# Altium schematic sheet DAC.SchDoc: Eval Board -  Analog outputs
size A3; Author: O. Guinnard; Organization: imperix Ltd; Address1: Rue de l'Industrie 10; Address2: 1950 Sion; Address3: Switzerland; Address4: +41 27 552 06 60; DocumentNumber: 2; SheetNumber: 2; SheetTotal: 7
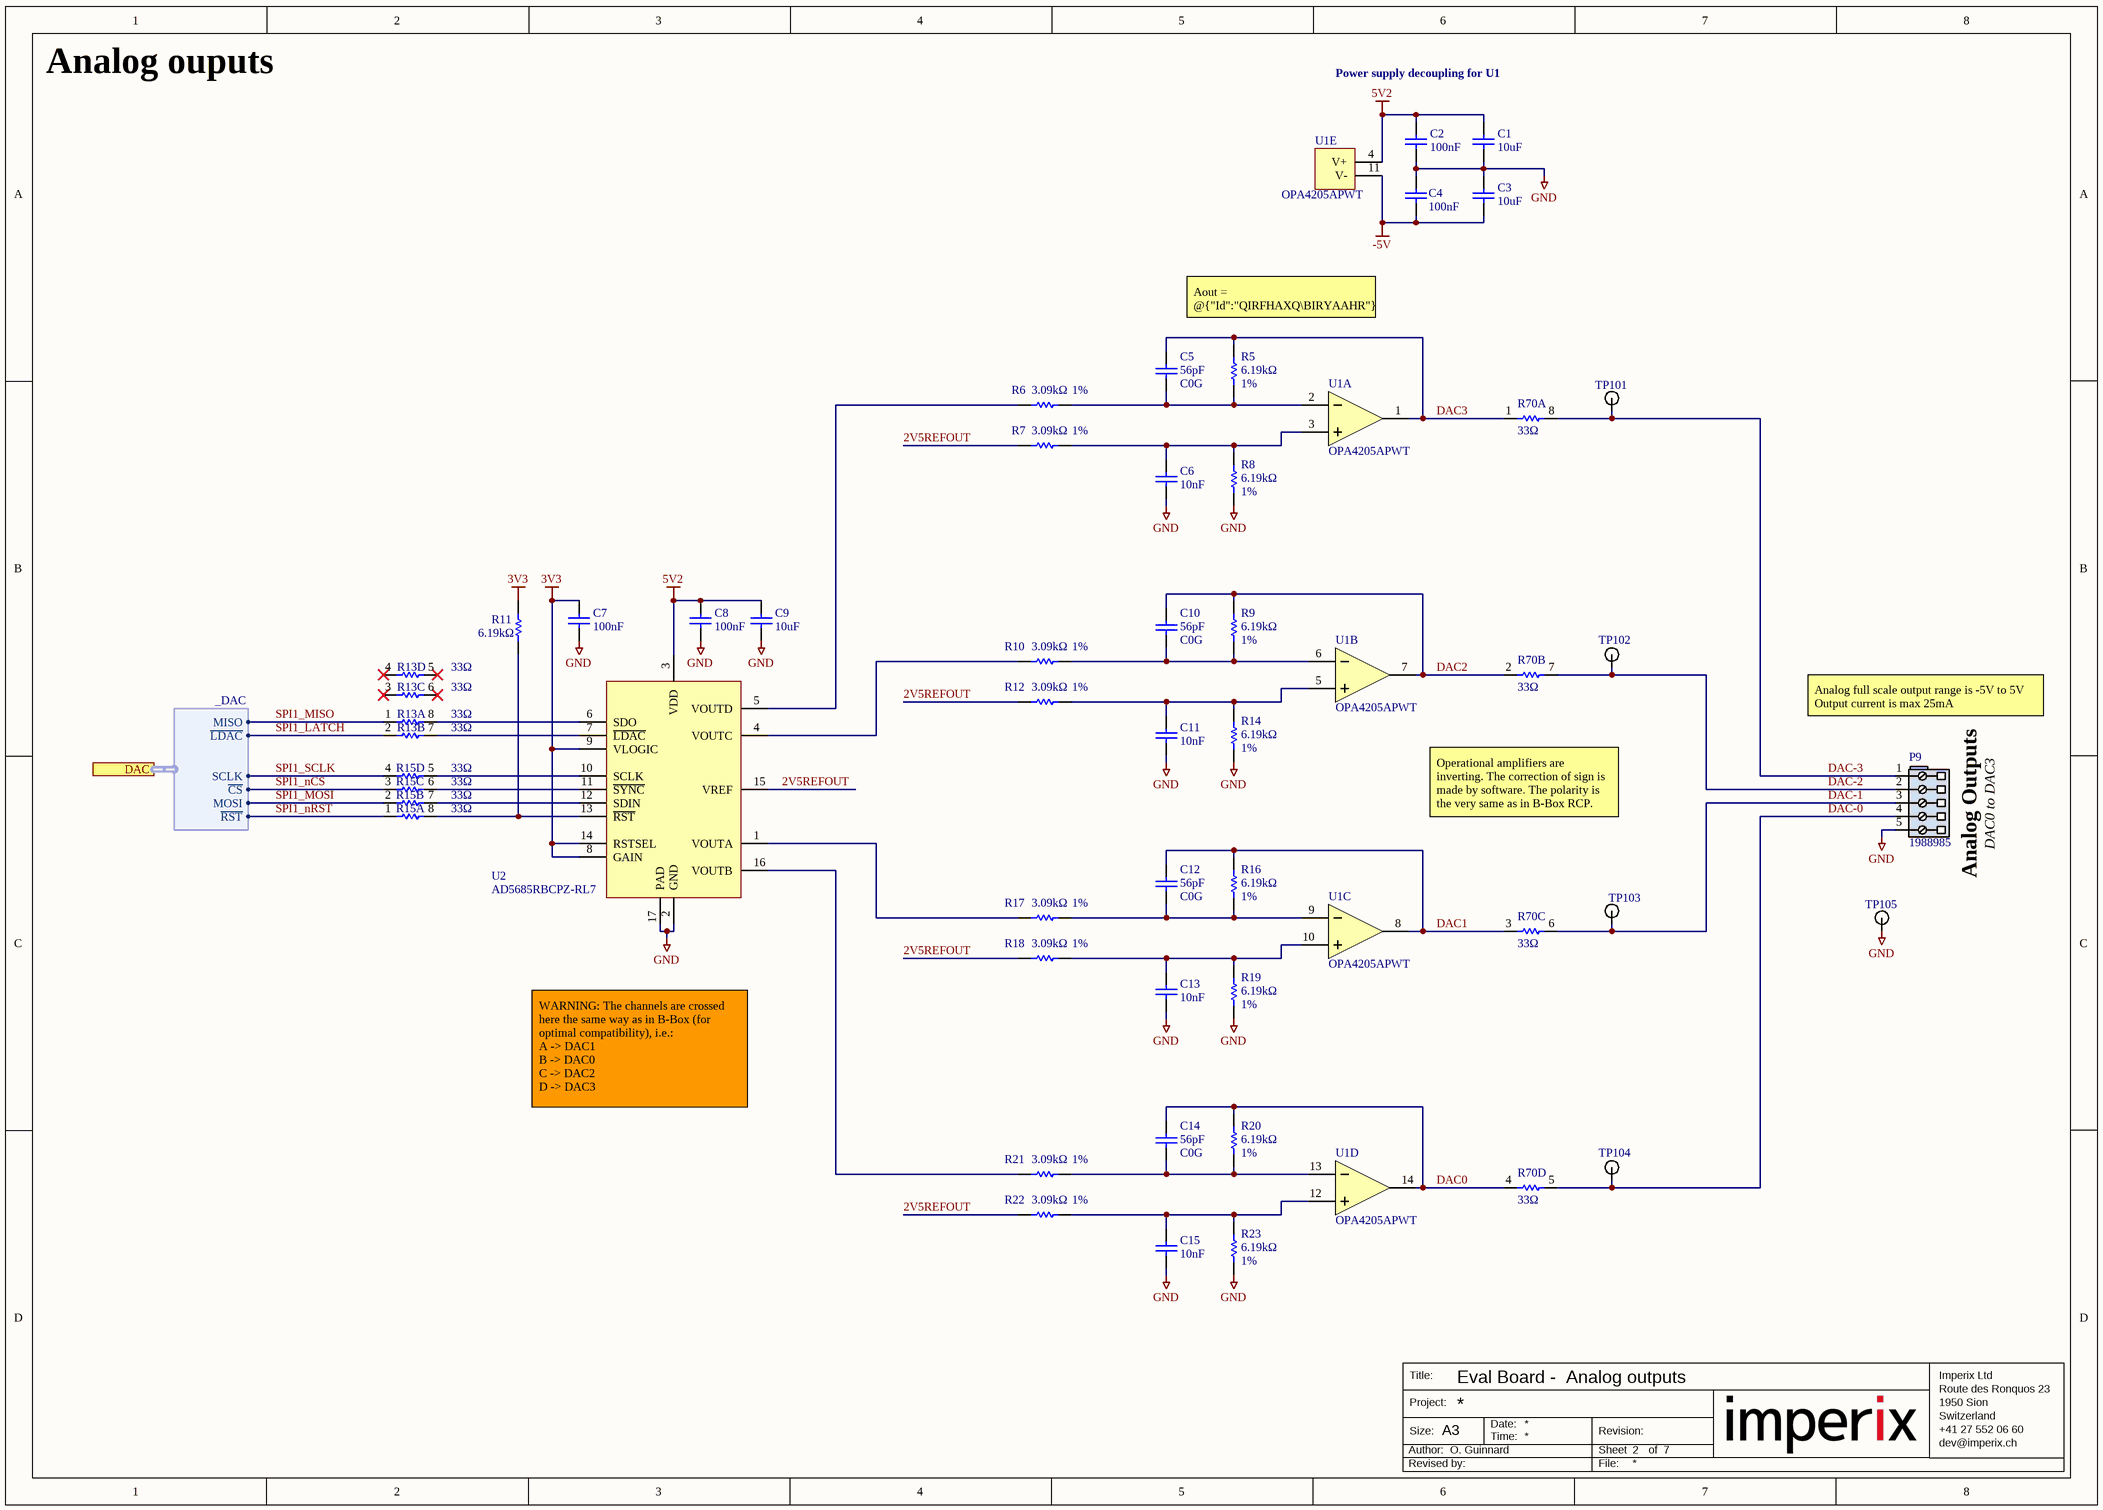
[diagram p0: DAC.SchDoc]

## Parts
C1  value 10uF  [CAPC1608L(0603)]  (hidden comment: CAP-10UF-10V-X5R-0603-10%)
C2  value 100nF  [CAPC1005L(0402)]  (hidden comment: CAP-100NF-25V-X7R-0402-10%)
C3  value 10uF  [CAPC1608L(0603)]  (hidden comment: CAP-10UF-10V-X5R-0603-10%)
C4  value 100nF  [CAPC1005L(0402)]  (hidden comment: CAP-100NF-25V-X7R-0402-10%)
C5  value 56pF  Dielectric: C0G  [CAPC1005L(0402)]  (hidden comment: CAP-56PF-50V-C0G-0402-1%)
C6  value 10nF  [CAPC1005L(0402)]  (hidden comment: CAP-10NF-25V-X7R-0402-10%)
C7  value 100nF  [CAPC1005L(0402)]  (hidden comment: CAP-100NF-25V-X7R-0402-10%)
C8  value 100nF  [CAPC1005L(0402)]  (hidden comment: CAP-100NF-25V-X7R-0402-10%)
C9  value 10uF  [CAPC1608L(0603)]  (hidden comment: CAP-10UF-10V-X5R-0603-10%)
C10  value 56pF  Dielectric: C0G  [CAPC1005L(0402)]  (hidden comment: CAP-56PF-50V-C0G-0402-1%)
C11  value 10nF  [CAPC1005L(0402)]  (hidden comment: CAP-10NF-25V-X7R-0402-10%)
C12  value 56pF  Dielectric: C0G  [CAPC1005L(0402)]  (hidden comment: CAP-56PF-50V-C0G-0402-1%)
C13  value 10nF  [CAPC1005L(0402)]  (hidden comment: CAP-10NF-25V-X7R-0402-10%)
C14  value 56pF  Dielectric: C0G  [CAPC1005L(0402)]  (hidden comment: CAP-56PF-50V-C0G-0402-1%)
C15  value 10nF  [CAPC1005L(0402)]  (hidden comment: CAP-10NF-25V-X7R-0402-10%)
P9  1988985  [1988985]
R5  value 6.19kΩ  Tolerance: 1%  [RESC1005L(0402)]  (hidden comment: RES-6.19KΩ-1/16W-100PPM-0402-1%)
R6  value 3.09kΩ  Tolerance: 1%  [RESC1005L(0402)]  (hidden comment: RES-3.09KΩ-1/16W-100PPM-0402-1%)
R7  value 3.09kΩ  Tolerance: 1%  [RESC1005L(0402)]  (hidden comment: RES-3.09KΩ-1/16W-100PPM-0402-1%)
R8  value 6.19kΩ  Tolerance: 1%  [RESC1005L(0402)]  (hidden comment: RES-6.19KΩ-1/16W-100PPM-0402-1%)
R9  value 6.19kΩ  Tolerance: 1%  [RESC1005L(0402)]  (hidden comment: RES-6.19KΩ-1/16W-100PPM-0402-1%)
R10  value 3.09kΩ  Tolerance: 1%  [RESC1005L(0402)]  (hidden comment: RES-3.09KΩ-1/16W-100PPM-0402-1%)
R11  value 6.19kΩ  [RESC1005L(0402)]  (hidden comment: RES-6.19KΩ-1/16W-100PPM-0402-1%)
R12  value 3.09kΩ  Tolerance: 1%  [RESC1005L(0402)]  (hidden comment: RES-3.09KΩ-1/16W-100PPM-0402-1%)
R13  value 33Ω  [RESQUAD0804]  (hidden comment: EXB-28V330JX)  (parts A,B,C,D of 4)
R14  value 6.19kΩ  Tolerance: 1%  [RESC1005L(0402)]  (hidden comment: RES-6.19KΩ-1/16W-100PPM-0402-1%)
R15  value 33Ω  [RESQUAD0804]  (hidden comment: EXB-28V330JX)  (parts A,B,C,D of 4)
R16  value 6.19kΩ  Tolerance: 1%  [RESC1005L(0402)]  (hidden comment: RES-6.19KΩ-1/16W-100PPM-0402-1%)
R17  value 3.09kΩ  Tolerance: 1%  [RESC1005L(0402)]  (hidden comment: RES-3.09KΩ-1/16W-100PPM-0402-1%)
R18  value 3.09kΩ  Tolerance: 1%  [RESC1005L(0402)]  (hidden comment: RES-3.09KΩ-1/16W-100PPM-0402-1%)
R19  value 6.19kΩ  Tolerance: 1%  [RESC1005L(0402)]  (hidden comment: RES-6.19KΩ-1/16W-100PPM-0402-1%)
R20  value 6.19kΩ  Tolerance: 1%  [RESC1005L(0402)]  (hidden comment: RES-6.19KΩ-1/16W-100PPM-0402-1%)
R21  value 3.09kΩ  Tolerance: 1%  [RESC1005L(0402)]  (hidden comment: RES-3.09KΩ-1/16W-100PPM-0402-1%)
R22  value 3.09kΩ  Tolerance: 1%  [RESC1005L(0402)]  (hidden comment: RES-3.09KΩ-1/16W-100PPM-0402-1%)
R23  value 6.19kΩ  Tolerance: 1%  [RESC1005L(0402)]  (hidden comment: RES-6.19KΩ-1/16W-100PPM-0402-1%)
R70  value 33Ω  [RESQUAD0804]  (hidden comment: EXB-28V330JX)  (parts A,B,C,D of 4)
TP101  5001  [5001]  (value not drawn)
TP102  5001  [5001]  (value not drawn)
TP103  5001  [5001]  (value not drawn)
TP104  5001  [5001]  (value not drawn)
TP105  5001  [5001]  (value not drawn)
U1  OPA4205APWT  [TSSOP65P640-14N]  (parts A,B,C,D,E of 5)
U2  AD5685RBCPZ-RL7  [QFN50P300X300-16WAL]

## Ports
DAC (harness _DAC)

## Harnesses
_DAC: MOSI, MISO, SCLK, ~{CS}, ~{LDAC}, ~{RST}

## Nets
3V3: C7.2 R11.2 U2.8(GAIN) U2.9(VLOGIC) U2.14(RSTSEL)
5V2: C1.2 C2.2 C8.2 C9.2 U1.4(V+) U2.3(VDD)
-5V: C3.1 C4.1 U1.11(V-)
GND: C1.1 C2.1 C3.2 C4.2 C6.1 C7.1 C8.1 C9.1 C11.1 C13.1 C15.1 P9.5 R8.1 R14.1 R19.1 R23.1 TP105.1(TP) U2.2(GND) U2.17(PAD)
2V5REFOUT: R7.2 R12.2 R18.2 R22.2 U2.15(VREF)
DAC0: C14.2 R20.2 R70.4 U1.14(OUT)
DAC1: C12.2 R16.2 R70.3 U1.8(OUT)
DAC2: C10.2 R9.2 R70.2 U1.7(OUT)
DAC3: C5.2 R5.2 R70.1 U1.1(OUT)
DAC-0: P9.4 R70.5 TP104.1(TP)
DAC-1: P9.3 R70.6 TP103.1(TP)
DAC-2: P9.2 R70.7 TP102.1(TP)
DAC-3: P9.1 R70.8 TP101.1(TP)
SPI1_LATCH: R13.2 ; port DAC.~{LDAC}
SPI1_MISO: R13.1 ; port DAC.MISO
SPI1_MOSI: R15.2 ; port DAC.MOSI
SPI1_nCS: R15.3 ; port DAC.~{CS}
SPI1_nRST: R15.1 ; port DAC.~{RST}
SPI1_SCLK: R15.4 ; port DAC.SCLK
NetC5_1: C5.1 R5.1 R6.1 U1.2(IN-)
NetC6_2: C6.2 R7.1 R8.2 U1.3(IN+)
NetC10_1: C10.1 R9.1 R10.1 U1.6(IN-)
NetC11_2: C11.2 R12.1 R14.2 U1.5(IN+)
NetC12_1: C12.1 R16.1 R17.1 U1.9(IN-)
NetC13_2: C13.2 R18.1 R19.2 U1.10(IN+)
NetC14_1: C14.1 R20.1 R21.1 U1.13(IN-)
NetC15_2: C15.2 R22.1 R23.2 U1.12(IN+)
NetR6_2: R6.2 U2.5(VOUTD)
NetR10_2: R10.2 U2.4(VOUTC)
NetR11_1: R11.1 R15.8 U2.13(~{RST})
NetR13_7: R13.7 U2.7(~{LDAC})
NetR13_8: R13.8 U2.6(SDO)
NetR15_5: R15.5 U2.10(SCLK)
NetR15_6: R15.6 U2.11(~{SYNC})
NetR15_7: R15.7 U2.12(SDIN)
NetR17_2: R17.2 U2.1(VOUTA)
NetR21_2: R21.2 U2.16(VOUTB)

Not connected (* = marked no-connect by the designer): R13 3* 4* 5* 6*

## Notes on the sheet
- Analog ouputs
- Power supply decoupling for U1
- Aout = @{"Id":"QIRFHAXQ\BIRYAAHR"} / @{"Id":"QIRFHAXQ\GPNTABEF"} *(Vref-Vin)
  = 2*(Vref-Vin)
- Analog full scale output range is -5V to 5V
  Output current is max 25mA
- Operational amplifiers are inverting. The correction of sign is made by software. The polarity is the very same as in B-Box RCP.
- (near P9) Analog Outputs
- DAC0 to DAC3
- WARNING: The channels are crossed here the same way as in B-Box (for optimal compatibility), i.e.:
  A -> DAC1
  B -> DAC0
  C -> DAC2
  D -> DAC3
- Title:
- Imperix Ltd
- Route des Ronquos 23
- Author:
- Project:
- Size:
- A3
- Date:
- Time:
- Revision:
- Sheet
- of
- 1950 Sion
- Switzerland
- +41 27 552 06 60
- dev@imperix.ch
- Revised by:
- File:

## Library data of the parts
C1 C3 C9 = CMP-055-000003-7: CAP CER 10UF 10V X5R 0603 10% (Generic Imperix Component); Tolerance: 10%; Dielectric: X5R; Voltage Rating (DC): 10V; Case/Package: 0603
C2 C4 C7 C8 = CMP-004-000006-18: CAP CER 100NF 25V X7R 0402 10% (Generic Imperix Component); Tolerance: 10%; Case/Package: 0402; Dielectric: X7R; Voltage Rating (DC): 25V
C5 C10 C12 C14 = CMP-027-000004-13: CAP CER 56PF 50V C0G 0402 1% (Generic Imperix Component); Tolerance: 1%; Case/Package: 0402; Voltage Rating (DC): 50V
C6 C11 C13 C15 = CMP-012-000001-12: CAP CER 10NF 25V X7R 0402 10% (Generic Imperix Component); Tolerance: 10%; Case/Package: 0402; Voltage Rating (DC): 25V; Dielectric: X7R
P9 = CMP-003-000046-13: Conn PC Terminal Block 5 POS 3.5mm Solder Thru-Hole 17.5A; Number of Poles: 5; Voltage: 300V; Current: 10A; Approvals: UL,EAC; Number of Levels: 1; Wire Gauge (Max): 26AWG; Gender: Male; Wire Gauge (Min): 16AWG; Voltage Rating: 160V; Number of Rows: 1; Mounting Technology: Through Hole; Lead Free: Lead Free; Color: Green; Number of Positions: 5; Orientation: Straight; Weight: 0.086068oz; Max Current Rating: 17.5A; Number of Circuits: 5; Number of Positions Per Level: 5; Packaging: Bulk; Pitch: 3.5mm; Current Rating: 17.5A; Material: Polyamide; Series: COMBICON PTA; Length: 11.2mm; Pins: 5; Height: 13.7mm; Housing Material: Nylon; Number of Contacts: 5; Contact Material: Tin; RoHS Compliant: Yes; Width: 17.5mm; Depth: 9.9mm; Housing Color: Green; Package Quantity: 100; Termination: Screw; Flammability Rating: UL94 V-0
R5 R8 R9 R11 R14 R16 R19 R20 R23 = CMP-009-000034-6: RES SMD 6.19KΩ 1/16W 100PPM 0402 1% (Generic Imperix Component); Temperature Coefficient: 100ppm/°C; Power Rating: 1/16W; Case/Package: 0402
  R11: Tolerance: 1%
R6 R7 R10 R12 R17 R18 R21 R22 = CMP-00012-1: RES SMD 3.09KΩ 1/16W 100PPM 0402 1% (Generic Imperix Component); Temperature Coefficient: 100ppm/°C; Power Rating: 1/16W; Case/Package: 0402
R13 R15 R70 = CMP-009-000035-3: Res Thick Film Array 33 Ohm 5% ±200ppm/°C ISOL 8-Pin 0804(4 X 0402) Convex SMD Automotive T/R; Power Rating: 62.5mW; Voltage Rating (DC): 100V; Circuit Type: Isolated; Power Dissipation: 63mW; Number of Elements: 4; Number of Contacts: 8; Voltage Rating: 50V; Tolerance: 5%; Pins: 8; Resistance Tolerance: 5%; Series: EXB; Min Operating Temperature: -55°C; Height: 0.35mm; Temperature Coefficient: 200ppm/°C; Length: 2mm; Package Quantity: 10000; Width: 1mm; Reach SVHC Compliant: No; Power Per Element: 62.5mW; Technology: THICK FILM; Termination: Convex; RoHS Compliant: Yes; Packaging: Tape and Reel; Case Code (Metric): 1005; Max Operating Temperature: 125°C; Lead Free: Lead Free; Case/Package: 0804; Mounting Technology: Surface Mount; Radiation Hardening: No; Military Standard: Not; Number of Resistors: 4; Depth: 1mm; Case Code (Imperial): 0402; Terminal Pitch: 0.5mm
TP101-TP105 = CMP-049-000000-14: Black PC Test Point, Miniature Phosphor Bronze Silver Plating Through Hole Mounting Type; Hole Diameter: 1.6mm; Inside Diameter: 1.27mm; Outside Diameter: 2.54mm; Number of Contacts: 1; Insulation: Insulated; Body Material: Bronze; Color: Black; Contact Material: Bronze; Contact Plating: Tin,Silver; Lead Free: Lead Free; Length: 7.62mm; Material: Nylon,Bronze,Silver; Mounting Technology: Through Hole; Package Quantity: 100; Packaging: Bulk; Reach SVHC Compliant: No; RoHS Compliant: Yes; Series: THM; Insulation Material: Nylon; Housing Color: Black; Orientation: Straight; Diameter: 2.54mm; Termination: Through Hole; Number of Ports: 1; Plating: Silver
U1 = CMP-00166-1: Precision Amplifiers Low-power low-noise four-channel precision amplifier with e-trim and super-beta inputs; Number of Channels: 4; Operating Supply Current: 0.24mA; Gain Bandwidth Product: 3.6MHz; Input Offset Voltage (Vos): 2uV; Input Bias Current: 100pA; Slew Rate: 4V/µs; Max Operating Temperature: 85°C; Pins: 14; Number of Circuits: 4; Packaging: Tape and Reel; Mounting Technology: Surface Mount; Case/Package: TSSOP-14; RoHS Compliant: Yes; Min Operating Temperature: -40°C
U2 = CMP-029-000000-12: DAC 4-CH Resistor-String 14-bit 16-Pin LFCSP EP T/R; Supply Type: Analog,Digital; Settling Time: 5us; Number of Converters: 4; Min Output Voltage: 2.7V; Min Input Voltage: 750mV; Sampling Rate: 25MS/s; Signal to Noise Ratio (SNR): 90dB; Power Dissipation: 7.15mW; Output Type: Voltage; Differential Output: No; Max Output Voltage: 5.5V; Supply Current: 1.1mA; Output Polarity: Unipolar; Integral Nonlinearity (INL): 1LSB; Interface: SPI,Serial; Resolution: 14b; Number of Bits: 14; Slew Rate: 0.8V/µs; Reach SVHC Compliant: No; Case/Package: QFN-16; Min Operating Temperature: -40°C; Series: nanoDAC+™; Contact Plating: Tin,Matte; Max Operating Temperature: 105°C; Min Supply Voltage: 2.7V; Number of DAC Channels: 4; Max Supply Voltage: 5.5V; RoHS Compliant: Yes; Package Quantity: 1500; Packaging: Tape and Reel; Lead Free: Contains Lead; Pins: 16; Number of D/A Converters: 4; Conversion Rate: 25MS/s